# EasyEDA Pro project ProPrj_Motor Driver Board v5.3.7.epro, board DRV8874 JST 6P Vertical
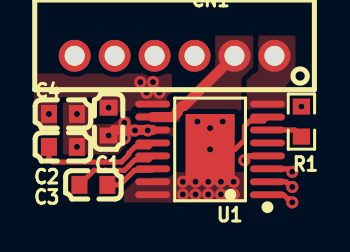
[diagram p6: board, top side]
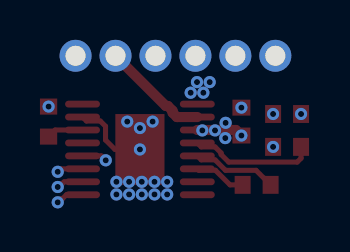
[diagram p7: board, bottom side, seen from below]

No outline. copper layers: Top Layer, Bottom Layer. Coordinates in mm from the lowest, leftmost part position.
Stack: Top Layer 0.035mm / Dielectric1 1.51mm FR4 er 4.5 / Bottom Layer 0.035mm

## Design rules (mm)
template: Custom Config
spacing copperThickness1oz (default): track to track 0.102, other pairs 0.152 to 0.3
spacing copperThickness2oz: track to track 0.203, other pairs 0.152 to 0.3
track width copperThickness1oz (default): min 0.127, default 0.254, max 2.54
track width copperThickness2oz: min 0.203, default 0.254, max 2.54
differential pair differentialPair (default): width min 0.127, default 0.254, max 2.54; gap min 0.152, default 0.152
via viaSize (default): diameter min 0.5, default 0.61, max 10; hole min 0.3, default 0.305, max 6.3

## Placement (name value [footprint] x y rotation side)
C1  100nF  [C0603]  2.29 3.17 90 top
C2  22nF  [C0603]  1.52 0 180 top
C3  100nF  [C0603]  0 1.91 0 top
C4  1uF  [C0603]  0 3.56 0 top
CN1  B6B-PH-K-S(LF)(SN)  [CONN-TH_B6B-PH-K-S]  5.59 6.48 0 top
R1  1kΩ  [R0603]  11.94 3.17 270 top
U1  DRV8874PWPR  [HTSSOP-16_L5.0-W4.4-P0.65-LS6.4-BL-EP]  7.37 1.78 90 top

## Footprints (pads in the part's own frame, mm; a bottom-side part is the same pattern mirrored in y, then rotated)
C0603
  rect 0.8x0.9 smd: 1(-0.7,0) 2(0.7,0)
CONN-TH_B6B-PH-K-S
  round 1.6 hole 1: 1(5,0) 2(3,0) 3(1,0) 4(-1,0) 5(-3,0) 6(-5,0)
HTSSOP-16_L5.0-W4.4-P0.65-LS6.4-BL-EP
  oval 0.343x1.746 smd: 1(-2.275,-2.873) 2(-1.625,-2.873) 3(-0.975,-2.873) 4(-0.325,-2.873) 5(0.325,-2.873) 6(0.975,-2.873) 7(1.625,-2.873) 8(2.275,-2.873) 9(2.275,2.873) 10(1.625,2.873) 11(0.975,2.873) 12(0.325,2.873) 13(-0.325,2.873) 14(-0.975,2.873) 15(-1.625,2.873) 16(-2.275,2.873)
  rect 3.55x2.46 smd: 17(0,0)
R0603
  rect 0.806x0.864 smd: 1(-0.753,0) 2(0.753,0)

## Nets
As in the schematic.

## Via types
v1: diameter 0.61, hole 0.305, Top Layer to Bottom Layer, 32 vias

## Routing (per net, layer and track width the routed paths; a pad name or vN(x,y) marks a point on that pad's centre or on a via; arc(x,y) is an arc through that point)
GND: length 3.9
  Top Layer w0.254: v1(7.37,1.78) 8.61,1.78 9.09,2.25 9.09,2.94 9.35,3.2 10.04,3.2 10.24,3.4
  vias: v1(-0.7,3.56) v1(2.29,3.88) v1(3.87,5.16) v1(4.19,4.62) v1(4.51,5.16) v1(4.83,4.62) v1(6,0.15) v1(6,-0.48) v1(6.64,0.15) v1(6.64,-0.48) v1(6.73,3.17) v1(7.27,0.15) v1(7.27,-0.48) v1(7.37,2.85) v1(7.91,0.15) v1(7.91,-0.48) v1(8,3.17) v1(8.54,0.15) v1(8.54,-0.48) v1(11.94,3.93)
VBATT: length 2.3
  Top Layer w0.508: v1(2.29,2.47) 2.56,2.75 4.49,2.75
  vias: v1(0.7,3.56) v1(0.7,1.91) v1(3.08,3.11) v1(3.09,2.35) v1(3.61,2.73) v1(4.24,2.73)
EN: length 1.4
  Top Layer w0.254: v1(11.48,-0.88) 11.29,-0.69 11.24,-0.69 11.04,-0.5 10.24,-0.5
IPROPI: length 1.8
  Top Layer w0.254: 10.24,2.75 11.61,2.75 R1.2
NFAULT: length 1.3
  Top Layer w0.254: v1(9.08,1.23) 9.3,1.45 10.24,1.45
NSLEEP: length 1.3
  Top Layer w0.254: v1(11.48,0.65) 11.33,0.8 10.24,0.8
OUT2: length 5.4
  Top Layer w0.508: CN1.2 6.07,3.96 5.97,3.96 5.73,3.72 5.73,3.62 5.51,3.4 U1.10
PH: length 1.3
  Top Layer w0.254: v1(11.48,-0.11) 11.3,0.07 11.24,0.07 11.16,0.15 10.24,0.15
$1N607: length 2.6
  Top Layer w0.254: U1.14 4.42,0.73 3.59,0.73 2.85,0 C2.1
$1N611: length 4.3
  Top Layer w0.254: C2.2 1.55,0.73 3.08,0.73 3.6,1.25 4.29,1.25 4.49,1.45
$1N695: length 6.3
  Top Layer w0.254: U1.12 4.29,1.9 3.6,1.9 3.3,1.6 3.3,1.52 2.92,1.14 -0.51,1.14 -0.7,1.33 C3.1

## Copper pours and planes (outline as drawn; the poured copper is in the pictures)
GND on Top Layer: 5.46,3.68 5.46,5.59 -1.45,5.59 -1.45,2.95 -0.28,2.85 -0.28,4.27 1.81,4.27 1.81,3.56 3.49,3.56 3.63,3.68
GND on Top Layer: 9.27,0.63 9.27,-0.89 3.05,-0.89 3.05,0 3.68,0.63
VBATT on Top Layer: 5.59,2.19 5.59,2.91 5.58,2.93 3.56,2.93 3.56,3.46 3,3.46 2.47,3.05 1.56,3.05 1.58,4.13 0,4.15 0,1.31 2.75,1.31 3.6,2.16 3.6,2.19
OUT1 on Top Layer: 11.18,3.68 9.14,3.68 9.14,5.43 9.53,5.82 9.53,7.49 11.64,7.49 11.64,5.46 11.18,5
OUT2 on Top Layer: 3.68,3.14 5.84,3.14 5.97,3.17 6.41,3.72 8.94,3.72 8.94,5.33 9.44,5.84 9.53,5.84 9.53,7.49 7.62,7.49 7.62,5.93 6.14,4.44 6.14,4.35 5.75,4.35 5.72,4.32 5.46,4.32 5.46,3.72 3.68,3.72
